# EAGLE design Power_board_2024 (EAGLE 9.6.2)
CHECKED: 02/25/2025; COMPANY: CDOSR; DATE: 02/25/2024; DESIGNER: CDOSR; DRAWN: 02/25/2024; DRGNO: 1; REV: 01; VERSION: v10; YEAR: 2024
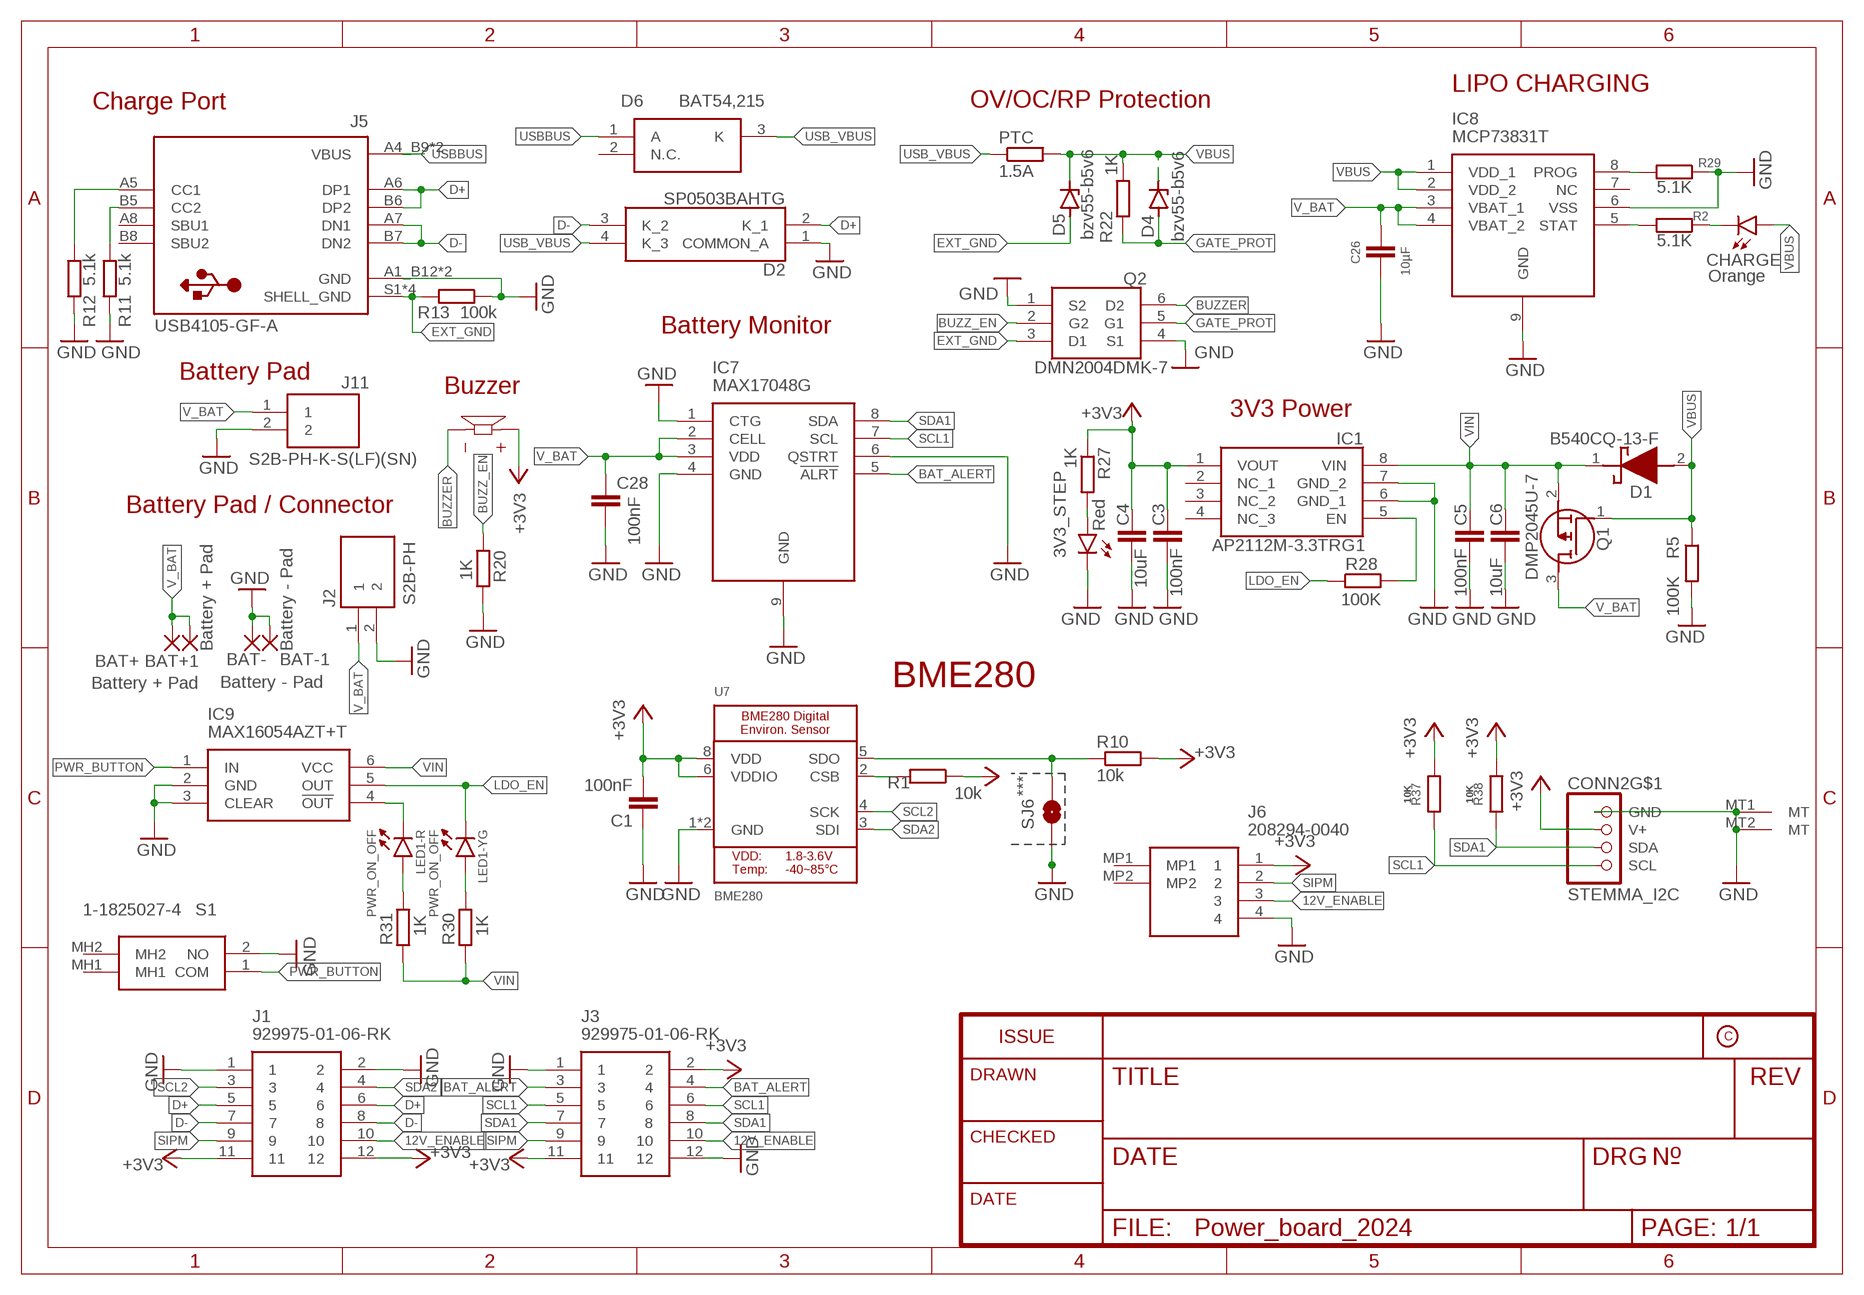
[diagram p0: schematic, sheet 1]

## Parts
3V3_STEP  Red  LEDCHIPLED_0805  [CHIPLED_0805]
BAT+  Battery + Pad  SMD5  [SMD2,54-5,08]
BAT+1  Battery + Pad  SMD5  [SMD2,54-5,08]
BAT-  Battery - Pad  SMD5  [SMD2,54-5,08]
BAT-1  Battery - Pad  SMD5  [SMD2,54-5,08]
BUZZER  CMI-1210-5-95T  [XDCR_CMI-1210-5-95T]
C1  100nF  C-EUC0603  [C0603]
C3  100nF  C-EUC0603  [C0603]
C4  10uF  C-EUC0603  [C0603]
C5  100nF  C-EUC0603  [C0603]
C6  10uF  C-EUC0603  [C0603]
C26  10µF  C-EUC0603  [C0603]
C28  100nF  C-EUC0603  [C0603]
CHARGE  Orange  LEDCHIPLED_0805  [CHIPLED_0805]
CONN2  STEMMA_I2C  STEMMA_I2C_QT  [JST_SH4]
D1  B540CQ-13-F  [DIOM7959X250N]
D2  SP0503BAHTG  [SP0503BAHTG]
D4  bzv55-b5v6  ZENER-DIODESOD80C  [SOD80C]
D5  bzv55-b5v6  ZENER-DIODESOD80C  [SOD80C]
D6  BAT54,215  [SOT95P230X110-3N]
IC1  AP2112M-3.3TRG1  [SOIC127P600X170-8N]
IC7  MAX17048G  MAX17048G+T10  [SON50P200X200X80-9N]
IC8  MCP73831T  MCP73831T-2ACI_MC  [SON50P300X200X100-9N]
IC9  MAX16054AZT+T  [SOT95P275X110-6N]
J1  929975-01-06-RK  [RHDR12W76P254_2X6_1524X508X839]
J2  S2B-PH  S2B-PH-K-S(LF)(SN)  [JST_S2B-PH-K-S(LF)(SN)]
J3  929975-01-06-RK  [RHDR12W76P254_2X6_1524X508X839]
J5  USB4105-GF-A  [GCT_USB4105-GF-A]
J6  208294-0040  [2082940040]
J11  S2B-PH-K-S(LF)(SN)  [JST_S2B-PH-K-S(LF)(SN)]
LED1  PWR_ON_OFF  OSRG1206C1C  [3216(1206)-4]
PTC  1.5A  R-EU_R2512  [R2512]
Q1  DMP2045U-7  [SOT96P240X110-3N]
Q2  DMN2004DMK-7  [SOT95P285X145-6N]
R1  10k  R-EU_R0603  [R0603]
R2  5.1K  R-EU_R0603  [R0603]
R5  100K  R-EU_R0603  [R0603]
R10  10k  R-EU_R0603  [R0603]
R11  5.1k  R-EU_R0603  [R0603]
R12  5.1k  R-EU_R0603  [R0603]
R13  100k  R-EU_R0603  [R0603]
R20  1K  R-EU_R0603  [R0603]
R22  1K  R-EU_R0603  [R0603]
R27  1K  R-EU_R0603  [R0603]
R28  100K  R-EU_R0603  [R0603]
R29  5.1K  R-EU_R0603  [R0603]
R30  1K  R-EU_R0603  [R0603]
R31  1K  R-EU_R0603  [R0603]
R37  10K  R-EU_R0603  [R0603]
R38  10K  R-EU_R0603  [R0603]
S1  1-1825027-4  [118250274]
SJ6  SOLDER_JUMPER  SPARKFUN_SOLDERJUMPERNO  [SPARKFUN_SJ_2S-NO]
U7  BME280  [BME280]

## Nets
12V_ENABLE: J1.10 J3.10 J6.3
+3V3: BUZZER.P C1.2 C3.2 C4.2 CONN2.2(V+) IC1.1(VOUT) J1.11 J1.12 J3.2 J3.11 J6.1 R1.1 R10.2 R27.1 R37.2 R38.2 U7.6(VDDIO) U7.8(VDD)
BAT_ALERT: IC7.5(!ALRT) J3.3 J3.4
BUZZ_EN: Q2.2(G2) R20.1
BUZZER: BUZZER.N Q2.6(D2)
D+: D2.2(K_1) J1.5 J1.6 J5.A6(DP1) J5.B6(DP2)
D-: D2.3(K_2) J1.7 J1.8 J5.A7(DN1) J5.B7(DN2)
EXT_GND: D5.A J5.S1(SHELL_GND) J5.S2(SHELL_GND) J5.S3(SHELL_GND) J5.S4(SHELL_GND) Q2.3(D1) R13.2
FSYNC2: R10.1 SJ6.2 U7.5(SDO)
GATE_PROT: D4.A Q2.5(G1) R22.1
GND: 3V3_STEP.C BAT-1.1(P) BAT-.1(P) C1.1 C3.1 C4.1 C5.1 C6.1 C26.2 C28.2 CONN2.1(GND) CONN2.MT1(MT) CONN2.MT2(MT) D2.1(COMMON_A) IC1.6(GND_1) IC1.7(GND_2) IC7.1(CTG) IC7.4(GND) IC7.6(QSTRT) IC7.9(GND) IC8.6(VSS) IC8.9(GND) IC9.2(GND) IC9.3(CLEAR) J1.1 J1.2 J2.2 J3.1 J3.12 J5.A1_B12(GND) J5.B1_A12(GND) J6.4 J11.2 Q2.1(S2) Q2.4(S1) R5.2 R11.1 R12.1 R13.1 R20.2 R29.1 S1.2(NO) SJ6.1 U7.1(GND) U7.7(GND)
LDO_EN: IC9.5(OUT) LED1.3(-YG:C) R28.1
N$1: R1.2 U7.2(CSB)
N$5: IC8.5(STAT) R2.2
N$9: CHARGE.C R2.1
N$11: IC8.8(PROG) R29.2
N$12: IC9.4(!OUT) LED1.1(-R:C)
N$13: IC1.5(EN) R28.2
N$14: LED1.4(-YG:A) R30.2
N$15: LED1.2(-R:A) R31.2
N$16: J5.B5(CC2) R11.2
N$21: J5.A5(CC1) R12.2
N$33: 3V3_STEP.A R27.2
PWR_BUTTON: IC9.1(IN) S1.1(COM)
SCL1: CONN2.4(SCL) IC7.7(SCL) J3.5 J3.6 R37.1
SCL2: J1.3 U7.4(SCK)
SDA1: CONN2.3(SDA) IC7.8(SDA) J3.7 J3.8 R38.1
SDA2: J1.4 U7.3(SDI)
SIPM: J1.9 J3.9 J6.2
USB_VBUS: D2.4(K_3) D6.3(K) PTC.1
USBBUS: D6.1(A) J5.A4_B9(VBUS) J5.B4_A9(VBUS)
V_BAT: BAT+1.1(P) BAT+.1(P) C26.1 C28.1 IC7.2(CELL) IC7.3(VDD) IC8.3(VBAT_1) IC8.4(VBAT_2) J2.1 J11.1 Q1.3(D)
VBUS: CHARGE.A D1.2(A) D4.C D5.C IC8.1(VDD_1) IC8.2(VDD_2) PTC.2 Q1.1(G) R5.1 R22.2
VIN: C5.2 C6.2 D1.1(K) IC1.8(VIN) IC9.6(VCC) Q1.2(S) R30.1 R31.1
Unconnected: D6.2(N.C.) IC1.2(NC_1) IC1.3(NC_2) IC1.4(NC_3) IC8.7(NC) J5.A8(SBU1) J5.B8(SBU2) J6.MP1 J6.MP2 S1.MH1 S1.MH2

## Notes on the sheet
- LIPO CHARGING
- Charge Port | OV/OC/RP Protection
- Battery Monitor
- Battery Pad
- Buzzer
- 3V3 Power
- Battery Pad / Connector
- BME280
- ***

## Library data of the parts
3V3_STEP CHARGE = led:LED: LED OSRAM: - CHIPLED LG R971, LG N971, LY N971, LG Q971, LY Q971, LO R971, LY R971 LH N974, LH R974 LS Q976, LO Q976, LY Q976 LO Q996 - Hyper CHIPLED LW Q18S LB Q993, LB Q99A, LB R99A - SideLED LS A670, LO A670, LY A670, LG A670, LP A670 LB A673, LV A673, LT A673, LW A673 LH A674 LY A675 LS A676, LA A676, LO A676, LY A676, LW A676 LS A679, LY A679, LG A679 - Hyper Micro SIDELED® LS Y876, LA Y876, LO Y876, LY Y876 LT Y87S - SmartLED LW L88C, LW L88S LB L89C, LB L89S, LG L890 LS L89K, LO L89K, LY L89K LS L896, LA L896, LO L896, LY L896 - TOPLED LS T670, LO T670, LY T670, LG T670, LP T670 LSG T670, LSP T670, LSY T670, LOP T670, LYG T670 LG T671, LOG T671, LSG T671 LB T673, LV T673, LT T673, LW T673 LH T674 LS T676, LA T676, LO T676, LY T676, LB T676, LH T676, LSB T676, LW T676 LB T67C, LV T67C, LT T67C, LS T67K, LO T67K, LY T67K, LW E67C LS E67B, LA E67B, LO E67B, LY E67B, LB E67C, LV E67C, LT E67C LW T67C LS T679, LY T679, LG T679 LS T770, LO T770, LY T770, LG T770, LP T770 LB T773, LV T773, LT T773, LW T773 LH T774 LS E675, LA E675, LY E675, LS T675 LS T776, LA T776, LO T776, LY T776, LB T776 LHGB T686 LT T68C, LB T68C - Hyper Mini TOPLED® LB M676 - Mini TOPLED Santana® LG M470 LS M47K, LO M47K, LY M47K Source: http://www.osram.convergy.de LUXEON: - LUMILED® LXK2-PW12-R00, LXK2-PW12-S00, LXK2-PW14-U00, LXK2-PW14-V00 LXK2-PM12-R00, LXK2-PM12-S00, LXK2-PM14-U00 LXK2-PE12-Q00, LXK2-PE12-R00, LXK2-PE12-S00, LXK2-PE14-T00, LXK2-PE14-U00 LXK2-PB12-K00, LXK2-PB12-L00, LXK2-PB12-M00, LXK2-PB14-N00, LXK2-PB14-P00, LXK2-PB14-Q00 LXK2-PR12-L00, LXK2-PR12-M00, LXK2-PR14-Q00, LXK2-PR14-R00 LXK2-PD12-Q00, LXK2-PD12-R00, LXK2-PD12-S00 LXK2-PH12-R00, LXK2-PH12-S00 LXK2-PL12-P00, LXK2-PL12-Q00, LXK2-PL12-R00 Source: www.luxeon.com KINGBRIGHT: KA-3528ASYC Source: www.kingbright.com
BAT+ BAT+1 BAT- BAT-1 = wirepad:SMD5: SMD PAD
BUZZER = CMI-1210-5-95T:CMI-1210-5-95T; MANUFACTURER: CUI Devices; MAXIMUM_PACKAGE_HEIGHT: 10mm; PARTREV: 1.0; SPICEPREFIX: B; STANDARD: Manufacturer Recommendations
C1 C3-C6 C26 C28 = rcl:C-EU: CAPACITOR, European symbol; SPICEPREFIX: C
CONN2 = microbuilder:STEMMA_I2C
D1 = B540CQ-13-F:B540CQ-13-F: DIODES INC. - B540CQ-13-F - Schottky Rectifier, 40 V, 5 A, Single, DO-214AB (SMC), 2 Pins, 550 mV Source: Datasheet <https://www.diodes.com/assets/Datasheets/ds13012.pdf>; DESCRIPTION: DIODES INC. - B540CQ-13-F - Schottky Rectifier, 40 V, 5 A, Single, DO-214AB (SMC), 2 Pins, 550 mV; HEIGHT: 2.5mm; MANUFACTURER_NAME: Diodes Inc.; MANUFACTURER_PART_NUMBER: B540CQ-13-F; MOUSER_PART_NUMBER: 621-B540CQ-13-F; MOUSER_PRICE-STOCK: https://www.mouser.co.uk/ProductDetail/Diodes-Incorporated/B540CQ-13-F?qs=BvpHGKeVh3rbtYAYW%2FUwCw%3D%3D
D2 = SP0503BAHTG:SP0503BAHTG: ESD Suppressors / TVS Diodes TVS AVAL DIODE SMT Source: Datasheet; DESCRIPTION: ESD Suppressors / TVS Diodes TVS AVAL DIODE SMT; HEIGHT: 1.22mm; MANUFACTURER_NAME: LITTELFUSE; MANUFACTURER_PART_NUMBER: SP0503BAHTG; MOUSER_PART_NUMBER: 576-SP0503BAHTG; MOUSER_PRICE-STOCK: https://www.mouser.co.uk/ProductDetail/Littelfuse/SP0503BAHTG?qs=uD%2FdkN7XIa0NTYXwHdELYA%3D%3D
D4 D5 = diode:ZENER-DIODE: Z-Diode
D6 = BAT54_215:BAT54,215: Schottky barrier diode,BAT54 0.2A 30V NXP BAT54,215, SMT Schottky Diode, 30V 200mA, 5ns, 3-Pin TO-236AB Source: Datasheet <https://assets.nexperia.com/documents/data-sheet/BAT54.pdf>; DESCRIPTION: Schottky barrier diode,BAT54 0.2A 30V NXP BAT54,215, SMT Schottky Diode, 30V 200mA, 5ns, 3-Pin TO-236AB; HEIGHT: 1.1mm; MANUFACTURER_NAME: Nexperia; MANUFACTURER_PART_NUMBER: BAT54,215; MOUSER_PART_NUMBER: 771-BAT54-T/R; MOUSER_PRICE-STOCK: https://www.mouser.co.uk/ProductDetail/Nexperia/BAT54215?qs=me8TqzrmIYXKuR53XX9Zmg%3D%3D
IC1 = AP2112M-3.3TRG1:AP2112M-3.3TRG1: LDO Voltage Regulators LDO CMOS HiCurr Source: Datasheet <https://www.diodes.com/assets/Datasheets/AP2112.pdf>; DESCRIPTION: LDO Voltage Regulators LDO CMOS HiCurr; HEIGHT: 1.7mm; MANUFACTURER_NAME: Diodes Inc.; MANUFACTURER_PART_NUMBER: AP2112M-3.3TRG1; MOUSER_PART_NUMBER: 621-AP2112M-3.3TRG1; MOUSER_PRICE-STOCK: https://www.mouser.co.uk/ProductDetail/Diodes-Incorporated/AP2112M-3.3TRG1?qs=5V6w%252Be2aIqa1YM8VADFBsQ%3D%3D
IC7 = MAX17048G+T10:MAX17048G+T10: Battery Management Host-Side Modelgauge (1-Cell) Source: Datasheet <https://datasheets.maximintegrated.com/en/ds/MAX17048-MAX17049.pdf>; DESCRIPTION: Battery Management Host-Side Modelgauge (1-Cell); HEIGHT: 0.8mm; MANUFACTURER_NAME: Maxim Integrated; MANUFACTURER_PART_NUMBER: MAX17048G+T10; MOUSER_PART_NUMBER: 700-MAX17048G+T10; MOUSER_PRICE-STOCK: https://www.mouser.co.uk/ProductDetail/Maxim-Integrated/MAX17048G%2bT10?qs=D7PJwyCwLAoGnnn8jEPRBQ%3D%3D
IC8 = MCP73831T-2ACI_MC:MCP73831T-2ACI_MC: MICROCHIP - MCP73831T-2ACI/MC - BATTERY CHARGER, LI-ION/POL, 0.5A, DFN-8 Source: Datasheet <http://ww1.microchip.com/downloads/en/DeviceDoc/20001984g.pdf>; DESCRIPTION: MICROCHIP - MCP73831T-2ACI/MC - BATTERY CHARGER, LI-ION/POL, 0.5A, DFN-8; HEIGHT: 1mm; MANUFACTURER_NAME: Microchip; MANUFACTURER_PART_NUMBER: MCP73831T-2ACI/MC; MOUSER_PART_NUMBER: 579-MCP73831T-2ACIMC; MOUSER_PRICE-STOCK: https://www.mouser.co.uk/ProductDetail/Microchip-Technology/MCP73831T-2ACI-MC?qs=yUQqVecv4quJ3ICqm%2FGZxw%3D%3D
IC9 = MAX16054AZT+T:MAX16054AZT+T: On Off Controller, Debounce, 15kV ESD MAX16054AZT+T, Voltage Supervisor No Push Button Controller 6-Pin SOT-23 Source: Datasheet <https://datasheet.datasheetarchive.com/originals/distributors/SFDatasheet-4/sf-00087822.pdf>; DESCRIPTION: On Off Controller, Debounce, 15kV ESD MAX16054AZT+T, Voltage Supervisor No Push Button Controller 6-Pin SOT-23; HEIGHT: 1.1mm; MANUFACTURER_NAME: Analog Devices; MANUFACTURER_PART_NUMBER: MAX16054AZT+T; MOUSER_PART_NUMBER: 700-MAX16054AZTT; MOUSER_PRICE-STOCK: https://www.mouser.co.uk/ProductDetail/Analog-Devices-Maxim-Integrated/MAX16054AZT%2bT?qs=CDqwynd4ZNoG75aAAjGoqQ%3D%3D
J1 J3 = 929975-01-06-RK:929975-01-06-RK: Headers & Wire Housings 2ROW BDMNT SCKT SN STRT SLDR TAIL Source: Datasheet <https://multimedia.3m.com/mws/media/22500O/3mtm-boardmount-skt-100-100x-100strt-sldr-tails-ts0815.pdf>; DESCRIPTION: Headers & Wire Housings 2ROW BDMNT SCKT SN STRT SLDR TAIL; HEIGHT: 8.387mm; MANUFACTURER_NAME: 3M; MANUFACTURER_PART_NUMBER: 929975-01-06-RK; MOUSER_PART_NUMBER: 517-929975-01-06-RK; MOUSER_PRICE-STOCK: https://www.mouser.co.uk/ProductDetail/3M-Electronic-Solutions-Division/929975-01-06-RK?qs=4V84emjyG36joYvi6g1rwA%3D%3D
J2 J11 = S2B-PH-K-S_LF__SN_:S2B-PH-K-S(LF)(SN): PH Series 2 Position 2.0 mm Through Hole Side Entry Shrouded Header Check availability <https://pricing.snapeda.com/parts/S2B-PH-K-S%28LF%29%28SN%29/JST%20Sales%20America%20Inc./view-part?ref=eda>; AVAILABILITY: In Stock; DESCRIPTION: Connector Header Through Hole, Right Angle 2 position 0.079 (2.00mm); MF: JST Sales America Inc.; MP: S2B-PH-K-S(LF)(SN); PACKAGE: None; PRICE: None; PURCHASE-URL: https://pricing.snapeda.com/search/part/S2B-PH-K-S(LF)(SN)/?ref=eda
J5 = USB4105-GF-A:USB4105-GF-A: USB-C (USB TYPE-C) USB 2.0 Receptacle Connector 24 (16+8 Dummy) Position Surface Mount, Right Angle; Through Hole Check availability <https://pricing.snapeda.com/parts/USB4105-GF-A/GCT/view-part?ref=eda>; AVAILABILITY: In Stock; DESCRIPTION: USB-C (USB TYPE-C) USB 2.0 Receptacle Connector 24 (16+8 Dummy) Position Surface Mount, Right Angle; Through Hole; MF: GCT; MP: USB4105-GF-A; PACKAGE: None; PRICE: None; PURCHASE-URL: https://pricing.snapeda.com/search/part/USB4105-GF-A/?ref=eda
J6 = 208294-0040:208294-0040: Headers & Wire Housings Pico-EZmate HC PCB Header 1.8mm Pitch Single Row Gold Plating 4 Ckts Source: Datasheet <https://www.molex.com/content/dam/molex/molex-dot-com/products/automated/en-us/salesdrawingpdf/208/208294/2082940040_sd.pdf>; DESCRIPTION: Headers & Wire Housings Pico-EZmate HC PCB Header 1.8mm Pitch Single Row Gold Plating 4 Ckts; HEIGHT: 1.8mm; MANUFACTURER_NAME: Molex; MANUFACTURER_PART_NUMBER: 208294-0040; MOUSER_PART_NUMBER: 538-208294-0040; MOUSER_PRICE-STOCK: https://www.mouser.co.uk/ProductDetail/Molex/208294-0040?qs=9vOqFld9vZUwMr2LolbSxw%3D%3D
LED1 = OSRG1206C1C:OSRG1206C1C: Bi-color LED Check availability <https://pricing.snapeda.com/parts/OSRG1206C1C/OptoSupply/view-part?ref=eda>; AVAILABILITY: Not in stock; CHECK_PRICES: https://www.snapeda.com/parts/OSRG1206C1C/OptoSupply/view-part/?ref=eda; DESCRIPTION: LED; SMD; 1206; red/green; 3.2x2.7mm; 120°; Variant: bicolour; MF: OptoSupply; MP: OSRG1206C1C; PACKAGE: None; PRICE: None; SNAPEDA_LINK: https://www.snapeda.com/parts/OSRG1206C1C/OptoSupply/view-part/?ref=snap
PTC R1 R2 R5 R10-R13 R20 R22 R27-R31 R37 R38 = rcl:R-EU_: RESISTOR, European symbol; SPICEPREFIX: R
Q1 = DMP2045U-7:DMP2045U-7: DMP2045U-7 P-Channel MOSFET, 3.5 (State) A, 4.3 (Steady) A, 20 V, 3-Pin SOT-23 Diodes Inc Source: Datasheet <https://www.diodes.com/assets/Datasheets/DMP2045U.pdf>; DESCRIPTION: DMP2045U-7 P-Channel MOSFET, 3.5 (State) A, 4.3 (Steady) A, 20 V, 3-Pin SOT-23 Diodes Inc; HEIGHT: 1.1mm; MANUFACTURER_NAME: Diodes Inc.; MANUFACTURER_PART_NUMBER: DMP2045U-7; MOUSER_PART_NUMBER: 621-DMP2045U-7; MOUSER_PRICE-STOCK: https://www.mouser.co.uk/ProductDetail/Diodes-Incorporated/DMP2045U-7?qs=rrS6PyfT74erdUwo5CgHTg%3D%3D
Q2 = DMN2004DMK-7:DMN2004DMK-7: Diodes Inc DMN2004DMK-7 Dual N-channel MOSFET Transistor, 0.54 A, 20 V, 6-Pin SOT-26 Source: Datasheet <https://componentsearchengine.com/Datasheets/1/DMN2004DMK-7.pdf>; DESCRIPTION: Diodes Inc DMN2004DMK-7 Dual N-channel MOSFET Transistor, 0.54 A, 20 V, 6-Pin SOT-26; HEIGHT: 1.45mm; MANUFACTURER_NAME: Diodes Inc.; MANUFACTURER_PART_NUMBER: DMN2004DMK-7; MOUSER_PART_NUMBER: 621-DMN2004DMK-7; MOUSER_PRICE-STOCK: https://www.mouser.co.uk/ProductDetail/Diodes-Incorporated/DMN2004DMK-7?qs=mQbszxtPdlMH8tFhUIsOEA%3D%3D
S1 = 1-1825027-4:1-1825027-4: Switch Tactile OFF (ON) SPST Round Button PC Pins 0.05A 24VDC 1.57N Thru-Hole Loose Source: Datasheet <https://componentsearchengine.com/Datasheets/1/1-1825027-4.pdf>; DESCRIPTION: Switch Tactile OFF (ON) SPST Round Button PC Pins 0.05A 24VDC 1.57N Thru-Hole Loose; HEIGHT: 7.01mm; MANUFACTURER_NAME: TE Connectivity; MANUFACTURER_PART_NUMBER: 1-1825027-4
SJ6 = Solderjumpers:SPARKFUN_SOLDERJUMPER: Solder Jumper Standard SMD solder jumper. Used to automate production. Two varients : Normally Open and Normally Closed are the same, but have different paste layers. NC will have a large amount of paste and should jumper during reflow.
U7 = Adafruit BME280:BME280: BME280 - Environmental Sensor (I2C + SPI)

## Net classes
0 Default: width 0.203 mm
1 highpower: width 0.305 mm, drill 0.483 mm
2 lowpower: width 0.254 mm, drill 0.483 mm

## Board
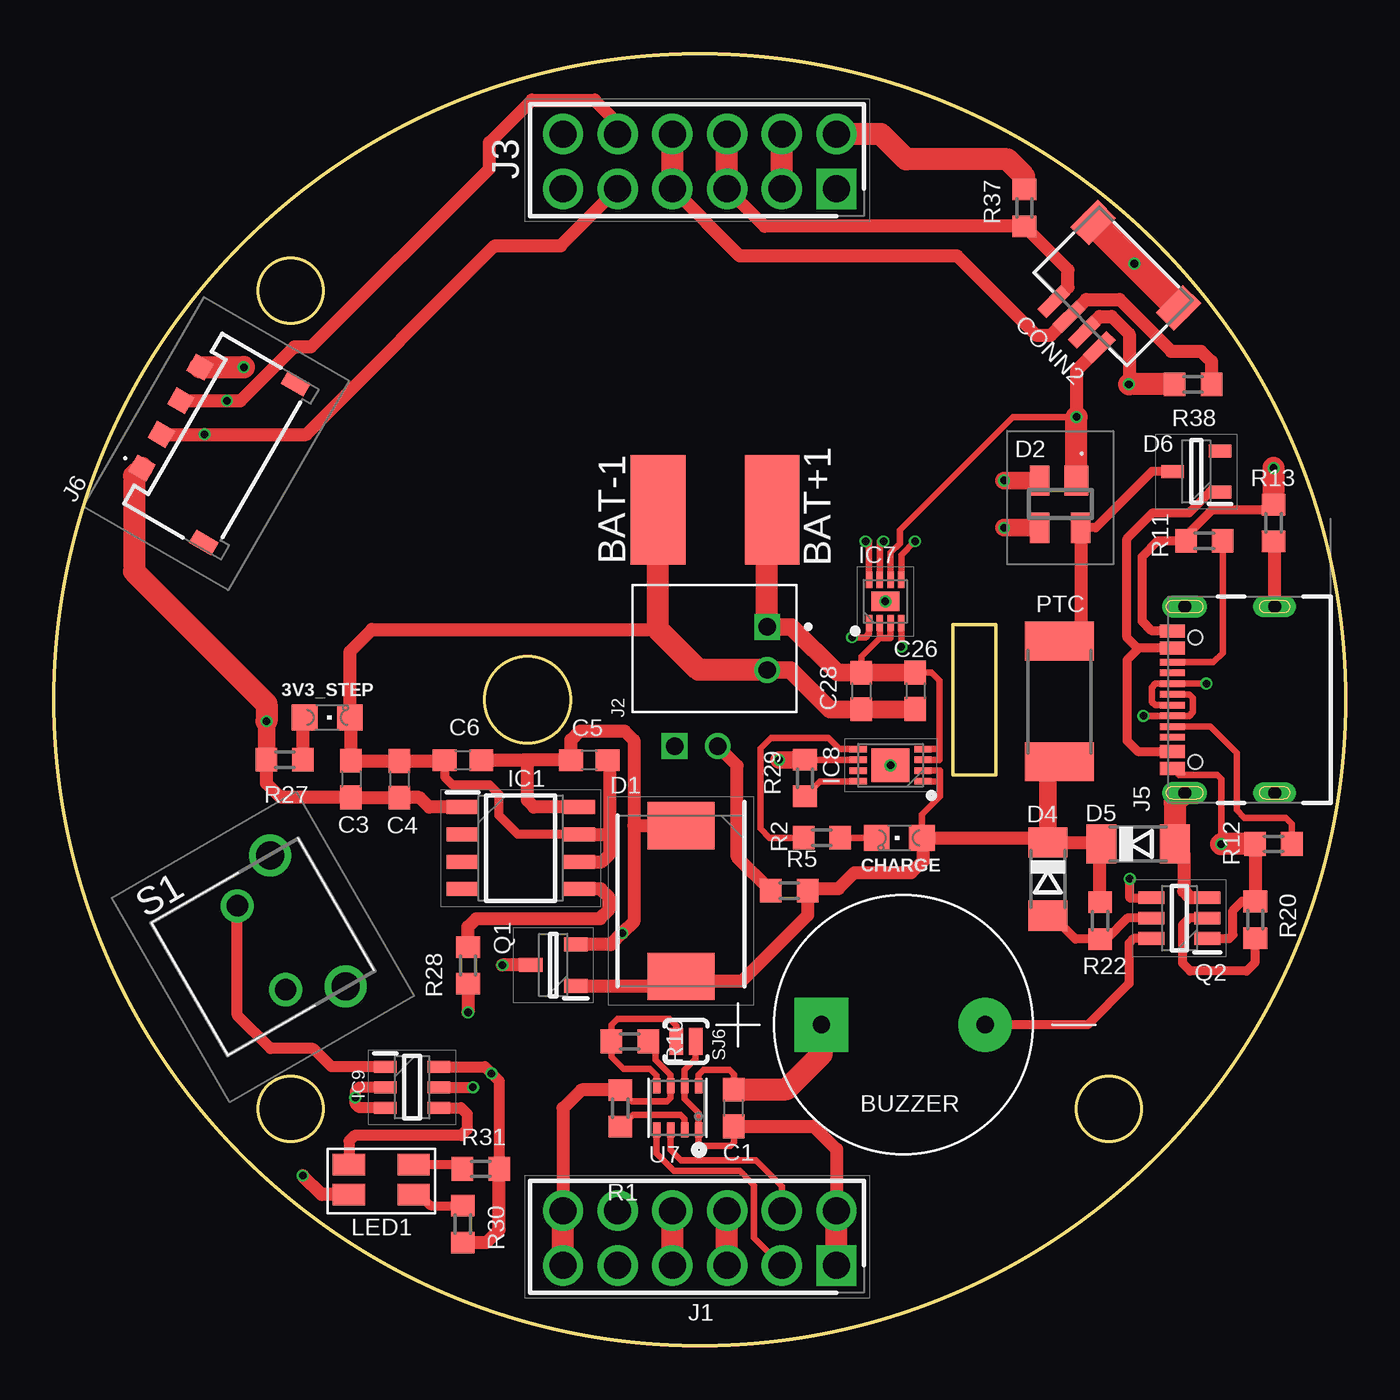
[diagram p1: board, top side]
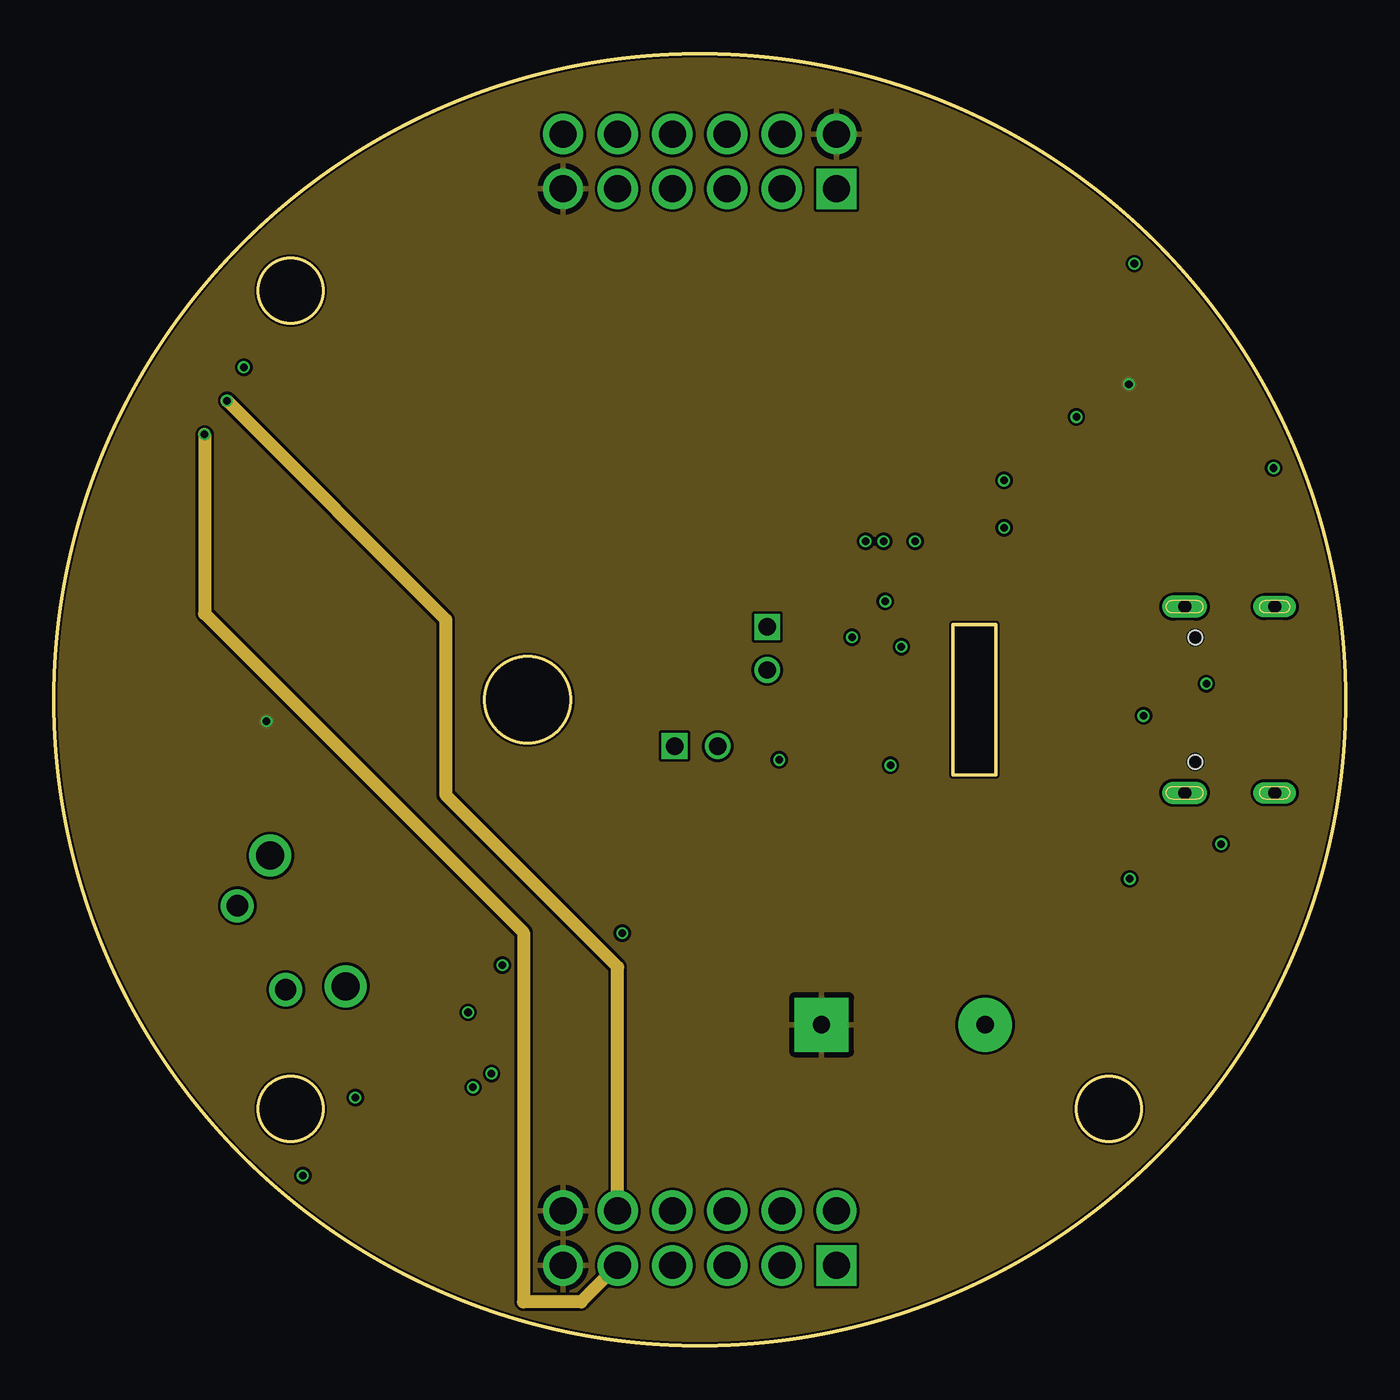
[diagram p2: board, inner layer Route2]
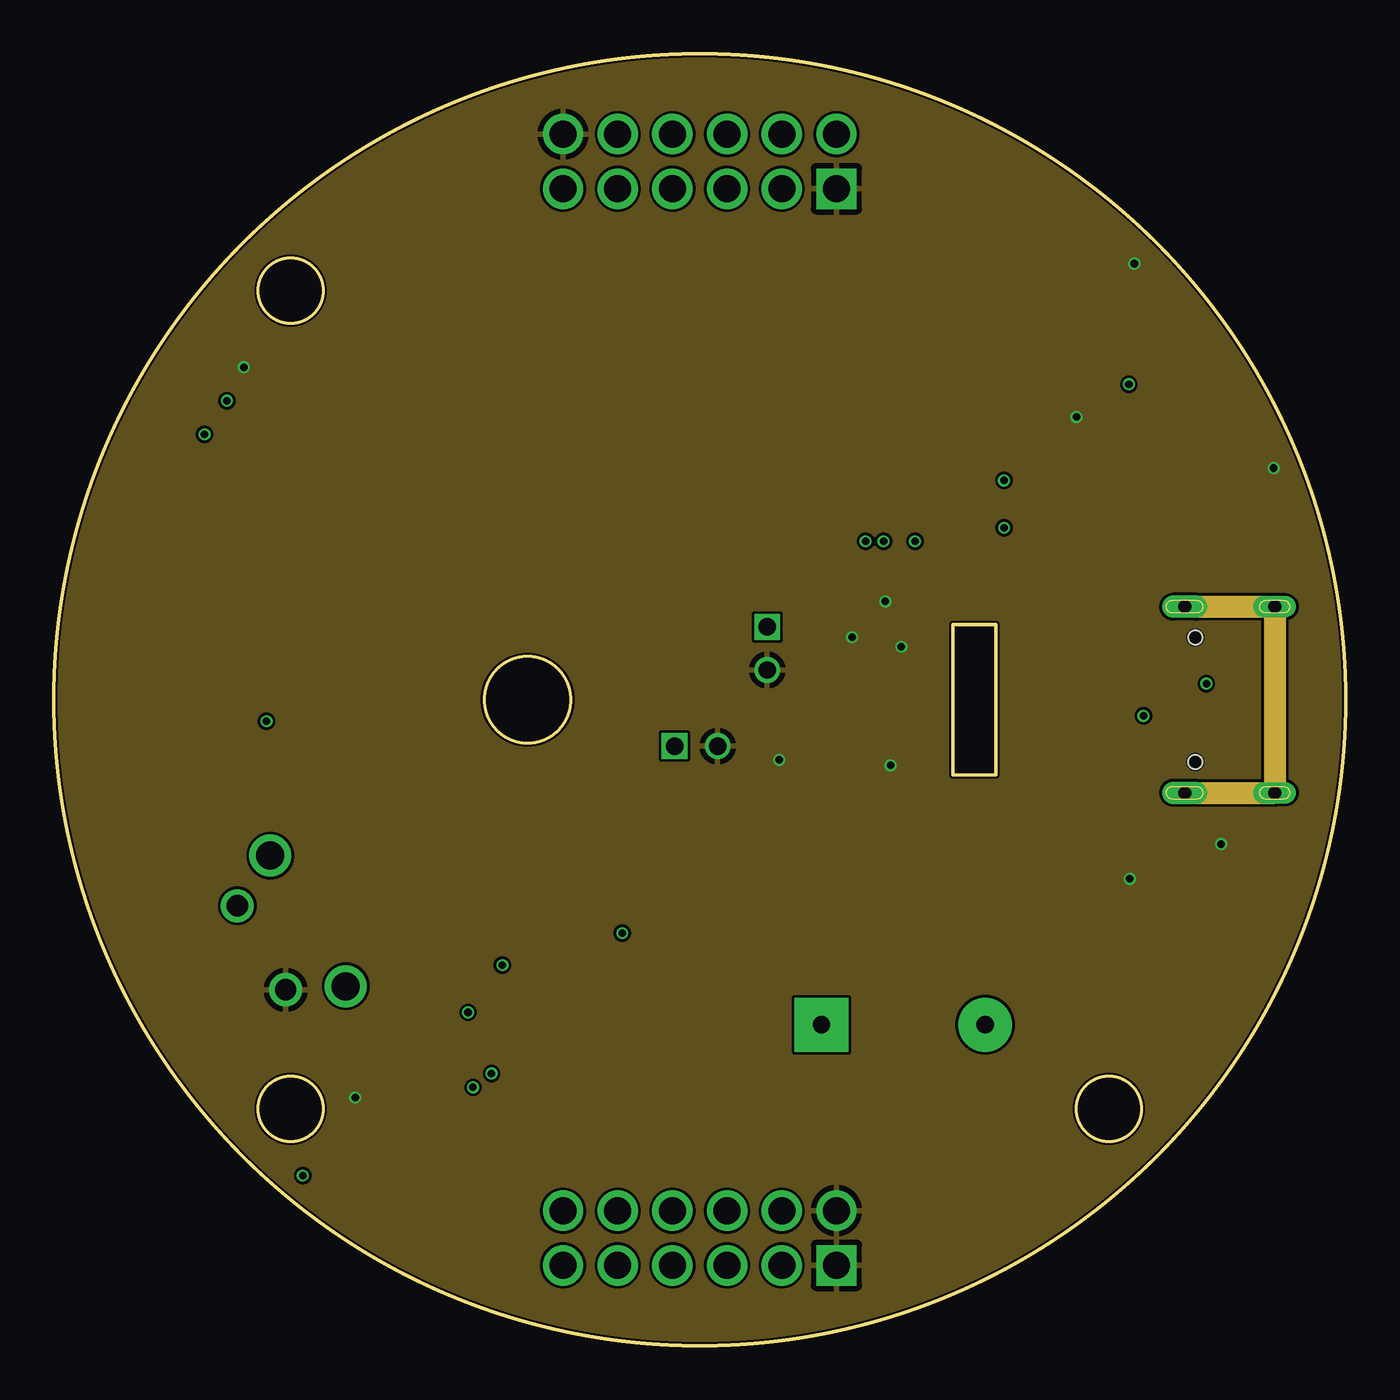
[diagram p3: board, inner layer Route15]
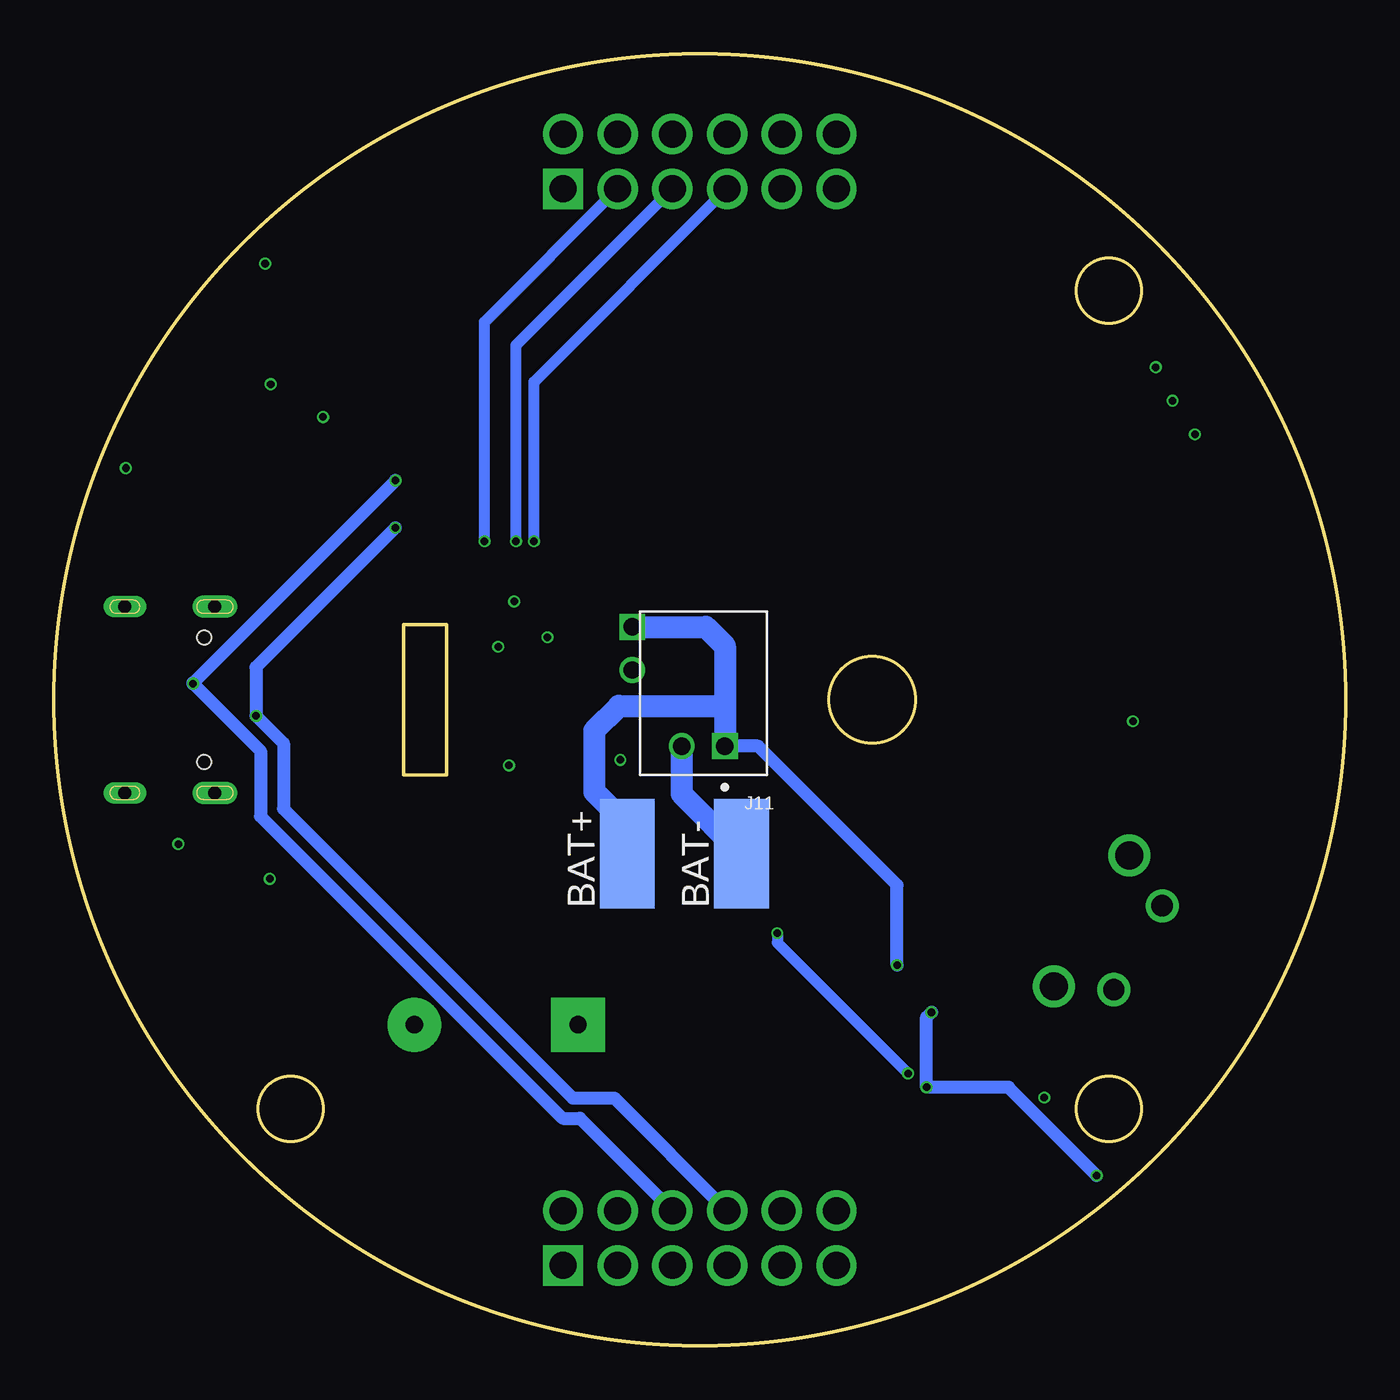
[diagram p4: board, bottom side, seen from below]

Size 60 x 60 mm. Coordinates in mm from the lower left corner, seen from the top.
Outline: 41.75,33.5 43.75,33.5 43.75,26.5 41.75,26.5 41.75,33.5
Outline: circle at 30,30 radius 30
Outline: circle at 11,49 radius 1.5
Outline: circle at 11,11 radius 1.5
Outline: circle at 49,11 radius 1.5
Outline: circle at 22,30 radius 2
Copper layers (1*2*15*16): Top 0.035559375mm / dielectric 0.17018125mm / Route2 0.01778125mm / dielectric 47mil / Route15 0.01778125mm / dielectric 0.17018125mm / Bottom 0.035559375mm
Design rules "jlcpcb-4-layer": minimum track width 5mil, minimum drill 0.2mm, track to track 0.126490625mm, track to pad 0.126490625mm, pad to pad 0.126490625mm, via to via 0.126490625mm, smd to smd 0mil, copper to edge 0.1mm, drill to drill 5mil, minimum pad ring 4mil, minimum via ring 4mil, stop-mask expansion 3mil, vias tented up to drill 100mil, thermal gap 10mil
Holes 3 mm at 11,49 11,11 49,11

### Footprints (pad centres in the part's own frame; a part is rotated, then mirrored left to right if it is on the bottom)
CHIPLED_0805 = smd 1.2 x 1.2: A 0,-1.05; C 0,1.05
SMD2,54-5,08 = smd 2.54 x 5.08: 1 0,0
XDCR_CMI-1210-5-95T = drill 0.8 pad 2.5: N 3.8,0 | drill 0.8 pad 2.5 square: P -3.8,0
C0603 = smd 1.1 x 1: 1 -0.85,0; 2 0.85,0
JST_SH4 = smd 0.6 x 1.55: 1 -1.5,2.514; 2 -0.5,2.514; 3 0.5,2.514; 4 1.5,2.514 | smd 1.2 x 1.8: MT1 -2.8,-1.386; MT2 2.8,-1.386
DIOM7959X250N = smd 2.2 x 3.1: 1 -3.5,0; 2 3.5,0
SP0503BAHTG = smd 1.1 x 1.4: 1 -0.75,-1.1 | smd 0.9 x 1.4: 2 0.95,-1.1; 3 0.95,1.1; 4 -0.95,1.1
SOD80C = smd 1.4 x 1.8: A 1.7,0; C -1.7,0
SOT95P230X110-3N = smd 1.05 x 0.6: 1 -1.1,0.95; 2 -1.1,-0.95; 3 1.1,0
SOIC127P600X170-8N = smd 1.5 x 0.65: 1 -2.7,1.905; 2 -2.7,0.635; 3 -2.7,-0.635; 4 -2.7,-1.905; 5 2.7,-1.905; 6 2.7,-0.635; 7 2.7,0.635; 8 2.7,1.905
SON50P200X200X80-9N = smd 0.75 x 0.3: 1 -1,0.75; 2 -1,0.25; 3 -1,-0.25; 4 -1,-0.75; 5 1,-0.75; 6 1,-0.25; 7 1,0.25; 8 1,0.75 | smd 0.9 x 1.3: 9 0,0
SON50P300X200X100-9N = smd 0.8 x 0.3: 1 -1.5,0.75; 2 -1.5,0.25; 3 -1.5,-0.25; 4 -1.5,-0.75; 5 1.5,-0.75; 6 1.5,-0.25; 7 1.5,0.25; 8 1.5,0.75 | smd 1.75 x 1.55: 9 0,0
SOT95P275X110-6N = smd 1.05 x 0.55: 1 -1.25,0.95; 2 -1.25,0; 3 -1.25,-0.95; 4 1.25,-0.95; 5 1.25,0; 6 1.25,0.95
RHDR12W76P254_2X6_1524X508X839 = drill 1.25 pad 1.875 square: 1 6.35,-1.27 | drill 1.25 pad 1.875: 2 6.35,1.27; 3 3.81,-1.27; 4 3.81,1.27; 5 1.27,-1.27; 6 1.27,1.27; 7 -1.27,-1.27; 8 -1.27,1.27; 9 -3.81,-1.27; 10 -3.81,1.27; 11 -6.35,-1.27; 12 -6.35,1.27
JST_S2B-PH-K-S(LF)(SN) = drill 0.8 square: 1 -1,0 | drill 0.8: 2 1,0
GCT_USB4105-GF-A = smd 0.6 x 1.15: A1_B12 -3.2,4.755; A4_B9 -2.4,4.755; B1_A12 3.2,4.755; B4_A9 2.4,4.755 | smd 0.3 x 1.15: A5 -1.25,4.755; A6 -0.25,4.755; A7 0.25,4.755; A8 1.25,4.755; B5 1.75,4.755; B6 0.75,4.755; B7 -0.75,4.755; B8 -1.75,4.755 | drill 0.6 pad 1.05 long: S1 -4.32,4.18; S4 4.32,4.18 | drill 0.6 pad 1 long: S2 -4.32,0; S3 4.32,0 | hole 0.65: 2.89,3.68; -2.89,3.68
2082940040 = smd 0.9 x 0.95: 1 -2.7,2.652; 2 -0.9,2.652; 3 0.9,2.652; 4 2.7,2.652 | smd 0.7 x 1.2: MP1 -4.265,-1.572; MP2 4.265,-1.572
3216(1206)-4 = smd 1.5 x 1: 1 -1.5,0.775; 2 1.5,0.775; 3 -1.5,-0.625; 4 1.5,-0.625
R2512 = smd 1.8 x 3.2: 1 -2.8,0; 2 2.8,0
SOT96P240X110-3N = smd 1.1 x 0.65: 1 -1.05,0.96; 2 -1.05,-0.96; 3 1.05,0
SOT95P285X145-6N = smd 1.2 x 0.6: 1 -1.3,0.95; 2 -1.3,0; 3 -1.3,-0.95; 4 1.3,-0.95; 5 1.3,0; 6 1.3,0.95
R0603 = smd 1 x 1.1: 1 -0.85,0; 2 0.85,0
118250274 = drill 0.99 pad 1.54: 1 0,0; 2 4.5,0 | drill 1.3 pad 1.95: MH1 -1.255,2.49; MH2 5.755,2.49
SPARKFUN_SJ_2S-NO = smd 0.635 x 1.27: 1 -0.45,0; 2 0.45,0
BME280 = smd 0.7 x 0.35: 1 1.025,0.975; 2 1.025,0.325; 3 1.025,-0.325; 4 1.025,-0.975; 5 -1.025,-0.975; 6 -1.025,-0.325; 7 -1.025,0.325; 8 -1.025,0.975

### Placement (x,y rotation side)
3V3_STEP  12.7,29.18 270 top
BAT+  33.36,22.85 0 bottom
BAT+1  33.36,38.82 0 top
BAT-  28.06,22.85 0 bottom
BAT-1  28.06,38.82 0 top
BUZZER  39.46,14.91 0 top
C1  31.58,11.04 90 top
C3  13.81,26.31 270 top
C4  16.05,26.31 270 top
C5  24.87,27.2 180 top
C6  19,27.2 0 top
C26  40.01,30.42 270 top
C28  37.5,30.41 270 top
CHARGE  39.27,23.58 90 top
CONN2  49.28,49.2 135 top
D1  29.13,20.65 270 top
D2  46.74,39.09 180 top
D4  46.17,21.67 270 top
D5  50.36,23.3 0 top
D6  53.06,40.6 180 top
IC1  21.69,23.11 0 top
IC7  38.61,34.57 90 top
IC8  38.86,26.96 180 top
IC9  16.64,12 0 top
J1  30,5 0 top
J2  33.13,32.38 270 top
J3  30,55 0 top
J5  56.7,30 90 top
J6  7.74,41.78 60 top
J11  29.84,27.85 180 bottom
LED1  15.21,7.65 0 top
PTC  46.7,29.92 270 top
Q1  23.2,17.68 180 top
Q2  52.27,19.86 180 top
R1  26.31,11.03 270 top
R2  35.67,23.59 180 top
R5  34.15,21.13 180 top
R10  26.75,14.13 0 top
R11  53.43,37.38 0 top
R12  56.65,23.3 0 top
R13  56.66,38.21 270 top
R20  55.8,19.78 90 top
R22  48.59,19.74 90 top
R27  10.73,27.21 0 top
R28  19.24,17.66 90 top
R29  34.88,26.36 270 top
R30  19,5.65 90 top
R31  19.83,8.21 180 top
R37  45.08,52.84 90 top
R38  52.91,44.65 180 top
S1  8.52,20.43 300 top
SJ6  29.36,14.13 180 top
U7  28.97,11.04 270 top

### Tracks (layer width: path | path; a pad name or v marks a point on that pad's centre or on a via)
12V_ENABLE  (via drill 0.35)
  Top 0.61: J6.3 v8.04,43.88 8.68,43.88 11.18,46.39 11.95,46.39 20.23,54.67 20.23,55.88 22.2,57.85 25.12,57.85 26.19,56.78 J3.10
  Route2 0.61: v8.04,43.88 18.2,33.73 18.2,25.58 26.19,17.59 J1.10
+3V3  (via drill 0.35)
  Top 0.305: R1.1 26.84,11.35 28.48,11.35 28.64,11.52 U7.6 28.64,12.57 27.95,13.27 27.95,13.78 R10.2 | U7.8 29.95,12.59 30.18,12.82 31.37,12.82 31.58,12.61 C1.2
  Top 0.61: CONN2.2 48.58,47.8 49.14,47.8 49.95,46.99 49.95,44.67 v49.93,44.65 | R27.1 9.88,26.12 10.54,25.46 C3.2 C4.2 16.99,25.46 17.43,25.02 IC1.1 | R1.1 24.5,11.88 23.65,11.03 J1.12
  Top 0.813: R27.1 v9.88,29
  Top 1.016: J1.11 J1.12 | R38.2 v49.93,44.65 | R37.2 45.08,54.31 44.29,55.1 39.58,55.1 38.41,56.27 J3.2 | J6.1 3.73,40.4 3.73,35.96 9.88,29.81 v9.88,29 | C1.2 31.6,11.91 34.03,11.91 35.66,13.54 BUZZER.P
  pour Route2: -5,65 65,65 65,-5 -5,-5
BAT_ALERT  (via drill 0.35)
  Top 0.305: v40,37.36 39.37,36.73 IC7.5
  Top 1.016: J3.3 J3.4
  Bottom 0.508: v40,37.36 40,47.54 J3.3
BUZZ_EN
  Top 0.406: Q2.2 52.73,19.86 52.41,19.54 52.41,17.77 52.78,17.4 55.4,17.4 55.8,17.8 R20.1
BUZZER
  Top 0.406: Q2.6 50.15,18.91 49.93,18.69 49.93,16.82 48.02,14.91 BUZZER.N
D+  (via drill 0.35)
  Top 0.305: J5.A6 51.15,29.75 51,29.9 51,30.58 51.17,30.75 J5.B6 v53.53,30.75
  Top 0.813: D2.2 v44.13,40.19
  Top 1.016: J1.5 J1.6
  Bottom 0.61: J1.6 35.56,10.56 36.37,10.56 50.4,24.59 50.4,27.62 v53.53,30.75 53.53,30.79 v44.13,40.19
D-  (via drill 0.35)
  Top 0.305: J5.A7 52.73,30.25 52.91,30.07 52.91,29.43 52.73,29.25 J5.B7 v50.61,29.25
  Top 0.813: D2.3 45.38,37.99 44.55,37.99 v44.14,37.99
  Top 1.016: J1.7 J1.8
  Bottom 0.61: J1.8 33.97,11.5 35.9,11.5 49.33,24.94 49.33,27.97 v50.61,29.25 50.61,31.51 v44.14,37.99
EXT_GND
  Top 0.61: Q2.3 52.79,20.81 52.48,21.12 52.48,22.88 D5.A | J5.S3 56.7,37.32 R13.2
  Top 1.016: J5.S1 52.06,25.22 D5.A
  Route15 1.016: J5.S1 J5.S2 J5.S3 J5.S4
FSYNC2
  Top 0.305: U7.5 28,12.55 27.7,12.85 26.47,12.85 25.9,13.42 R10.1 25.9,14.9 26.17,15.17 28.6,15.17 28.91,14.86 SJ6.2
GATE_PROT
  Top 0.406: D4.A 46.37,19.97 47.45,18.89 R22.1 48.9,18.89 49.87,19.86 Q2.5
GND  (via drill 0.35)
  Top 0.305: C1.1 31.58,9.44 31.43,9.29 30.07,9.29 29.95,9.41 U7.1 29.95,10.82 29.3,11.46 U7.7 29.3,12.8 29.81,13.32 SJ6.1 | J5.A1_B12 52.25,26.5 54.03,26.5 54.22,26.31 v54.22,23.3 | IC8.6 R29.1 | 38.12,34.79 38.12,34.86 38.41,34.57 IC7.9 38.83,34.57 39.11,34.29 39.11,34.34 39.11,34.35 | IC7.4 v39.37,32.46 | IC7.1 37.87,33.06 37.7,32.9 v37.07,32.9 | IC7.6 38.87,36.84 39.29,37.26 39.29,37.87 44.55,43.13 v47.49,43.13
  Top 0.406: Q2.4 50.95,20.78 50.01,20.78 49.97,20.82 v49.97,21.68 | Q2.1 54.59,18.91 54.76,19.08 54.76,20.21 55.18,20.63 R20.2 | J5.B1_A12 51,33.2 50.55,33.65 50.55,36.65 51.28,37.38 R11.1 52.58,37.61 53.78,38.8 56.39,38.8 R13.1 | IC1.7 21.55,23.75 20.67,24.63 20.67,25.61 20.23,26.05 18.52,26.05 18.15,26.42 C6.1
  Top 0.508: IC9.2 14.19,12 14,11.81 v14,11.52 14,11.23 14.18,11.05 IC9.3
  Top 0.61: R20.2 R12.1 | CONN2.1 47.49,45.3 v47.49,43.13 | 40,29.56 C26.2 | R5.2 31.74,22.7 31.74,26.94 J11.2 | C6.1 18.11,27.16 C4.1 C3.1 13.81,29.12 3V3_STEP.C 13.75,32.24 14.78,33.27 28.06,33.27 | IC1.6 25.46,22.48 25.83,22.85 25.83,23.74 | 25.83,23.74 25.83,27.09 C5.1 | IC1.7 25.82,23.75 25.83,23.74 | C1.1 35.29,10.19 36.35,9.13 J1.2
  Top 0.813: 40,29.56 C28.2 36.05,29.56 34.22,31.39 J2.2 | R29.1 v33.69,27.21
  Top 1.016: J1.1 J1.2 | R12.1 v54.22,23.3 | R13.1 v56.66,40.76 | D2.1 v47.49,43.13 | J2.2 29.95,31.39 28.06,33.27 BAT-1.1 | J6.4 v8.82,45.44 v8.83,45.45
  Top 1.27: CONN2.MT2 v50.18,50.25 CONN2.MT1
  Bottom 1.016: BAT-.1 30.84,25.62 J11.2
  other vias: 38.61,34.57 38.86,26.96
  pour Route15: -3,63 63,63 63,-3 -3,-3
LDO_EN  (via drill 0.35)
  Top 0.508: IC9.5 v19.47,12
  Top 0.61: LED1.3 12.44,7.02 v11.56,7.9 | R28.1 v19.24,15.48
  Bottom 0.61: v11.56,7.9 15.66,12 v19.47,12 19.47,15.25 v19.24,15.48
N$1
  Top 0.305: U7.2 29.3,10.54 29.11,10.72 26.9,10.72 26.36,10.18 R1.2
N$5
  Top 0.305: IC8.5 36.49,27.7 35.98,28.22 33.3,28.22 32.81,27.73 32.81,24.02 33.24,23.59 R2.2
N$9
  Top 0.305: R2.1 CHARGE.C
N$11
  Top 0.305: IC8.8 35.58,26.2 R29.2
N$12
  Top 0.508: IC9.4 18.91,11.05 19.2,10.76 19.2,10.04 18.92,9.76 13.96,9.76 13.71,9.51 LED1.1
N$13
  Top 0.61: R28.2 19.24,19.45 19.63,19.84 25.37,19.84 25.78,20.25 25.78,20.84 25.4,21.22 IC1.5
N$14
  Top 0.406: LED1.4 16.98,7.02 17.5,6.5 R30.2
N$15
  Top 0.406: LED1.2 18.77,8.42 R31.2
N$16
  Top 0.305: J5.B5 53.86,31.75 54.28,32.17 R11.2
N$21
  Top 0.305: R12.2 57.5,24.24 57.22,24.52 55.3,24.52 54.94,24.88 54.94,27.53 53.72,28.75 J5.A5
N$33
  Top 0.61: R27.2 11.58,29.11 3V3_STEP.A
PWR_BUTTON
  Top 0.508: IC9.1 12.9,12.95 12.05,13.8 10.06,13.8 8.52,15.34 S1.1
SCL1  (via drill 0.35)
  Top 0.305: IC7.7 38.37,37.36 v38.54,37.36
  Top 0.61: CONN2.4 47.1,49.15 47.1,49.97 R37.1 33.01,51.99 J3.5
  Top 1.016: J3.5 J3.6
  Bottom 0.508: v38.54,37.36 38.54,46.46 J3.5
SCL2
  Top 0.305: U7.4 28,8.93 28.81,8.11 31.86,8.11 32.52,7.45 32.52,5.02 J1.3
SDA1  (via drill 0.35)
  Top 0.305: IC7.8 37.87,37.36 v37.7,37.36
  Top 0.61: R38.1 53.76,45.71 53.28,46.19 51.9,46.19 49.5,48.59 47.96,48.59 CONN2.3 46.29,46.92 45.65,46.92 41.96,50.61 31.85,50.61 J3.7
  Top 1.016: J3.7 J3.8
  Bottom 0.508: v37.7,37.36 37.7,44.76 J3.7
SDA2
  Top 0.305: U7.3 28.64,9.09 29.13,8.6 32.6,8.6 33.81,7.39 J1.4
SIPM  (via drill 0.35)
  Top 0.61: J6.2 v7,42.33 11.73,42.33 20.48,51.08 23.54,51.08 J3.9
  Route2 0.61: v7,42.33 7,34 21.81,19.19 21.81,2.03 24.49,2.03 J1.9
USB_VBUS
  Top 0.406: D6.3 51,40.6 48.39,37.99 D2.4
  Top 0.61: D2.4 47.69,32.78 47.63,32.72 PTC.1
USBBUS
  Top 0.406: J5.A4_B9 50.34,27.6 49.84,28.11 49.84,31.84 50.39,32.4 J5.B4_A9 50.32,32.4 49.84,32.88 49.84,37.48 51.05,38.69 52.73,38.69 53.69,39.65 D6.1
V_BAT  (via drill 0.35)
  Top 0.305: IC8.3 41.14,27.2 41.14,27.7 | 41.14,27.7 IC8.4 | 41.14,27.7 41.14,30.89 40.76,31.27 C26.1 | IC7.2 38.37,32.87 | 38.37,32.87 38.87,32.87 IC7.3 | 38.37,32.87 37.5,32.01 C28.1
  Top 0.61: C28.1 | Q1.3 v20.84,17.68
  Top 0.813: J2.1 34.27,33.38 36.39,31.26 C28.1 | C28.1 40,31.26 C26.1
  Top 1.016: J2.1 33.13,38.59 BAT+1.1
  Bottom 0.61: J11.1 27.29,27.84 20.84,21.39 v20.84,17.68
  Bottom 1.016: BAT+.1 33.36,24.19 34.9,25.73 34.9,28.57 33.76,29.71 28.84,29.71 J11.1 28.84,32.51 29.71,33.38 J2.1
VBUS
  Top 0.305: IC8.1 41.15,26.2 | 41.15,26.2 41.15,26.7 IC8.2 | 41.15,26.2 41.15,25.5 40.32,24.67 CHARGE.A
  Top 0.61: R22.2 48.59,23.36 | D5.C 48.59,23.36 | 48.59,23.36 48.58,23.37 D4.C 45.96,23.58 CHARGE.A 40.39,23.51 40.39,22.53 39.83,21.97 37.19,21.97 36.45,21.23 35.1,21.23 R5.1 35,19.99 31.94,16.93 29.35,16.93 D1.2 28.69,16.71 Q1.1
  Top 0.813: D4.C 46.17,26.59 PTC.2
VIN  (via drill 0.35)
  Top 0.508: IC9.6 20.02,12.95 v20.33,12.64 20.68,12.29 R31.1
  Top 0.61: IC1.8 22.3,25.02 21.98,25.34 21.98,26.99 21.77,27.2 | C6.2 21.77,27.2 | 21.77,27.2 C5.2 24.02,28.14 24.42,28.54 26.51,28.54 26.94,28.11 26.94,24.15 | Q1.2 25.88,18.63 v26.4,19.16 26.94,19.7 26.94,24.15 | R30.1 20.09,4.8 20.68,5.39 R31.1 | D1.1 26.94,24.15
  Bottom 0.508: v26.4,19.16 26.4,18.71 v20.33,12.64